# Altium schematic sheet HEATER.SchDoc
size 420 x 297 mm; SheetNumber: 19; SheetTotal: 27
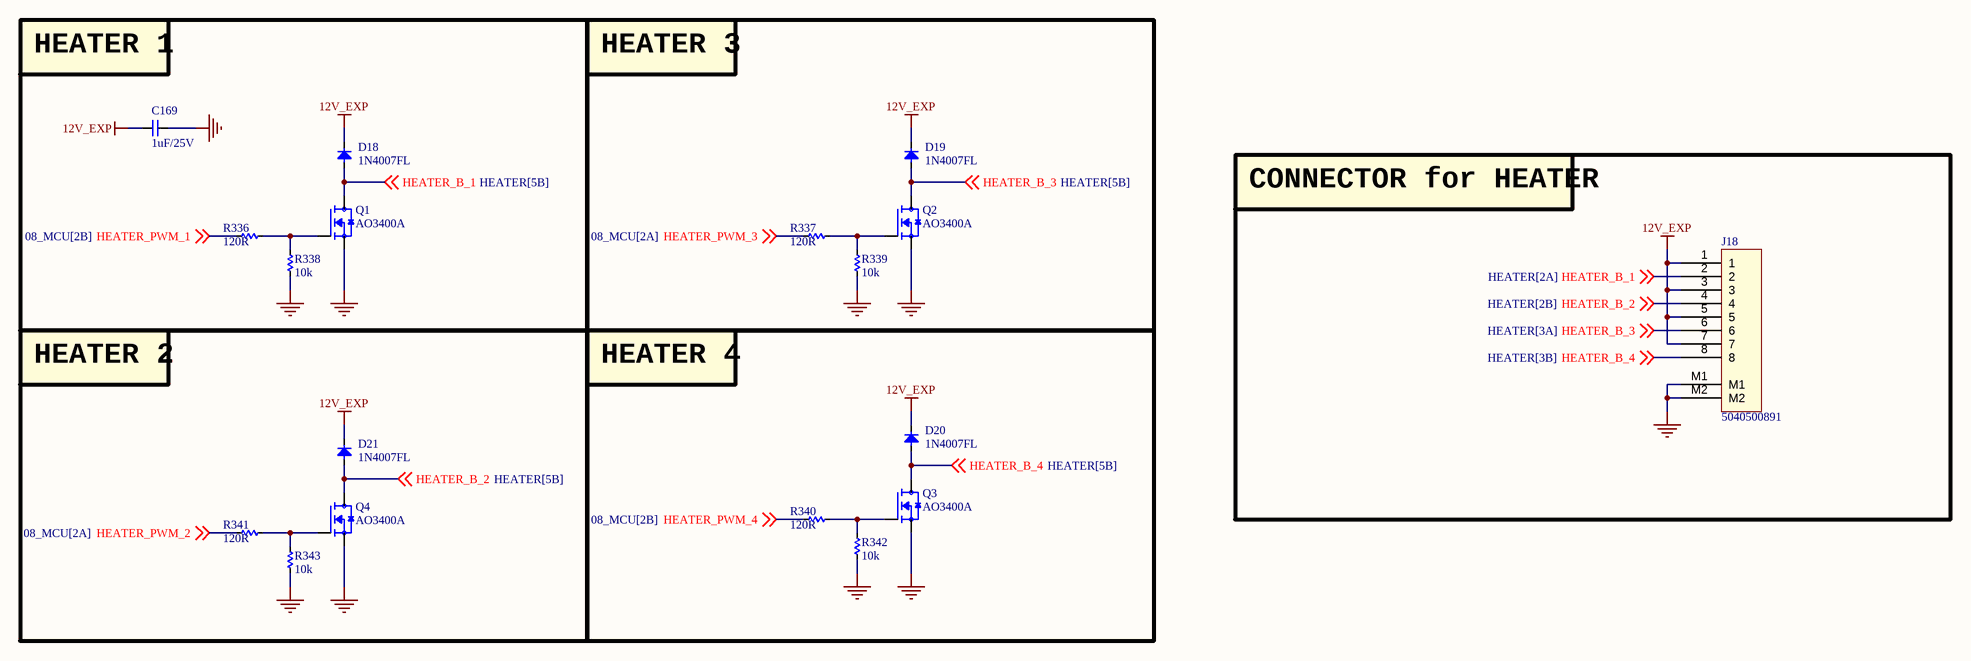
[diagram p0: HEATER.SchDoc]

## Parts
C169  1uF/25V  [CAP_C_1005X60]
D18  1N4007FL  [SOD3717X145N]
D19  1N4007FL  [SOD3717X145N]
D20  1N4007FL  [SOD3717X145N]
D21  1N4007FL  [SOD3717X145N]
J18  5040500891  [MOLEX_5040500891]
Q1  AO3400A  [SOT95P240X120-3N]
Q2  AO3400A  [SOT95P240X120-3N]
Q3  AO3400A  [SOT95P240X120-3N]
Q4  AO3400A  [SOT95P240X120-3N]
R336  120R  [RES_C_1005X40]
R337  120R  [RES_C_1005X40]
R338  10k  [RES_C_1005X40]
R339  10k  [RES_C_1005X40]
R340  120R  [RES_C_1005X40]
R341  120R  [RES_C_1005X40]
R342  10k  [RES_C_1005X40]
R343  10k  [RES_C_1005X40]

## Blocks framed on the sheet
HEATER 1: C169 D18 Q1 R336 R338
HEATER 3: D19 Q2 R337 R339
CONNECTOR for HEATER: J18
HEATER 2: D21 Q4 R341 R343
HEATER 4: D20 Q3 R340 R342

## Nets
12V_EXP: C169.2 D18.1(K) D19.1(K) D20.1(K) D21.1(K) J18.1 J18.3 J18.5 J18.7
GND: C169.1 J18.M1 J18.M2 Q1.2(S) Q2.2(S) Q3.2(S) Q4.2(S) R338.1 R339.1 R342.1 R343.1
HEATER_B_1: D18.2(A) J18.2 Q1.3(D) ; off-sheet HEATER_B_1
HEATER_B_2: D21.2(A) J18.4 Q4.3(D) ; off-sheet HEATER_B_2
HEATER_B_3: D19.2(A) J18.6 Q2.3(D) ; off-sheet HEATER_B_3
HEATER_B_4: D20.2(A) J18.8 Q3.3(D) ; off-sheet HEATER_B_4
HEATER_PWM_1: R336.1 ; off-sheet HEATER_PWM_1
HEATER_PWM_2: R341.1 ; off-sheet HEATER_PWM_2
HEATER_PWM_3: R337.1 ; off-sheet HEATER_PWM_3
HEATER_PWM_4: R340.1 ; off-sheet HEATER_PWM_4
NetQ1_1: Q1.1(G) R336.2 R338.2
NetQ2_1: Q2.1(G) R337.2 R339.2
NetQ3_1: Q3.1(G) R340.2 R342.2
NetQ4_1: Q4.1(G) R341.2 R343.2

## Notes on the sheet
- Project
- Sub-system:
- Design by:
- Sheet title:
- Sheet:
- of
- Checked by:
- Approved by:
- Doc no:
- Revision
- Size:
- Date:

## Library data of the parts
C169 = _CAP_C_2: CAP
D18-D21 = Diode SMD: Default Diode; Code - JEDEC: DO-214-AB; Value: 1N5007; Published: 8-Jun-2000; Revision: July-2002: Re-released for DXP Platform.; Publisher: Altium Limited
J18 = Header 8x1_2M
Q1-Q4 = MOSFET_N: N-Channel 30 V 5.7A (Ta) 1.4W (Ta) Surface Mount SOT-23-3; MF: Alpha & Omega Semiconductor; SnapEDA_Link: https://www.snapeda.com/parts/AO3400A/Alpha/view-part/?ref=snap; Package: SOT-23 Alpha &amp; Omega Semiconductor Inc.; Value: *; MP: AO3400A; Check_prices: https://www.snapeda.com/parts/AO3400A/Alpha/view-part/?ref=eda
R336-R343 = _RES_B_2: RES